# EAGLE design LE1-4 (EAGLE 8.5.1)
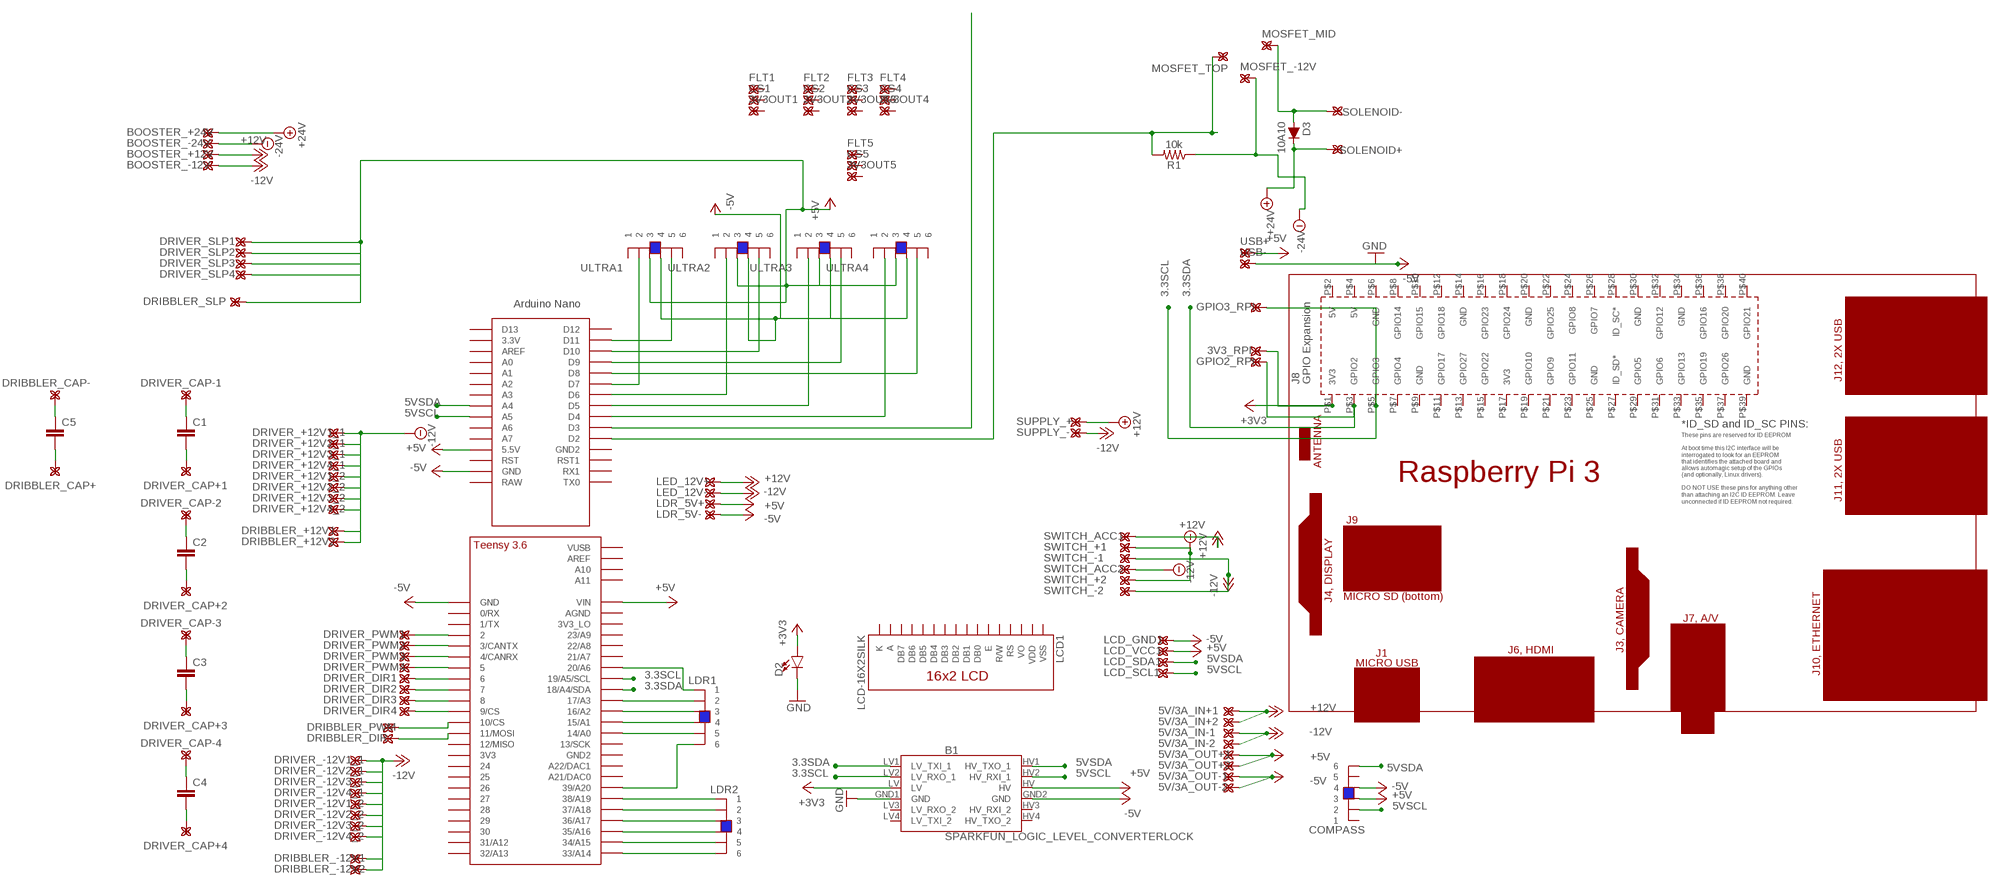
[diagram p0: schematic, sheet 1]

## Parts
3V3_RPI  BETTERPAD_2.54  [SUPERIORSIM]
3V3OUT1  BETTERPAD_2.54  [SUPERIORSIM]
3V3OUT2  BETTERPAD_2.54  [SUPERIORSIM]
3V3OUT3  BETTERPAD_2.54  [SUPERIORSIM]
3V3OUT4  BETTERPAD_2.54  [SUPERIORSIM]
3V3OUT5  BETTERPAD_2.54  [SUPERIORSIM]
5V/3A_IN+1  BETTERPAD_2.54  [SUPERIORSIM]
5V/3A_IN+2  BETTERPAD_2.54  [SUPERIORSIM]
5V/3A_IN-1  BETTERPAD_2.54  [SUPERIORSIM]
5V/3A_IN-2  BETTERPAD_2.54  [SUPERIORSIM]
5V/3A_OUT+1  BETTERPAD_2.54  [SUPERIORSIM]
5V/3A_OUT+2  BETTERPAD_2.54  [SUPERIORSIM]
5V/3A_OUT-1  BETTERPAD_2.54  [SUPERIORSIM]
5V/3A_OUT-2  BETTERPAD_2.54  [SUPERIORSIM]
B1  SPARKFUN_LOGIC_LEVEL_CONVERTERLOCK  [SPARKFUN_LOGIC_LEVEL_CONVERTER_LOCK]
BOOSTER_+12V  BETTERPAD_2.54  [SUPERIORSIM]
BOOSTER_+24V  BETTERPAD_2.54  [SUPERIORSIM]
BOOSTER_-12V  BETTERPAD_2.54  [SUPERIORSIM]
BOOSTER_-24V  BETTERPAD_2.54  [SUPERIORSIM]
C1  C5/7.2  [C5B7.2]
C2  C5/7.2  [C5B7.2]
C3  C5/7.2  [C5B7.2]
C4  C5/7.2  [C5B7.2]
C5  C5/7.2  [C5B7.2]
COMPASS  6P6C_FEMALESMD  [6P6C_FEMALE]
CS1  BETTERPAD_2.54  [SUPERIORSIM]
CS2  BETTERPAD_2.54  [SUPERIORSIM]
CS3  BETTERPAD_2.54  [SUPERIORSIM]
CS4  BETTERPAD_2.54  [SUPERIORSIM]
CS5  BETTERPAD_2.54  [SUPERIORSIM]
D2  LED-3MM-NO_SILK  [LED_3MM-NS]
D3  10A10  DIODE-1N4148  [DIODE-1N4148]
DRIBBLER_+12V1  BETTERPAD_2.54  [SUPERIORSIM]
DRIBBLER_+12V2  BETTERPAD_2.54  [SUPERIORSIM]
DRIBBLER_-12V1  BETTERPAD_2.54  [SUPERIORSIM]
DRIBBLER_-12V2  BETTERPAD_2.54  [SUPERIORSIM]
DRIBBLER_CAP+  BETTERPAD_2.54  [SUPERIORSIM]
DRIBBLER_CAP-  BETTERPAD_2.54  [SUPERIORSIM]
DRIBBLER_DIR  BETTERPAD_2.54  [SUPERIORSIM]
DRIBBLER_PWM  BETTERPAD_2.54  [SUPERIORSIM]
DRIBBLER_SLP  BETTERPAD_2.54  [SUPERIORSIM]
DRIVER_+12V1_1  BETTERPAD_2.54  [SUPERIORSIM]
DRIVER_+12V1_2  BETTERPAD_2.54  [SUPERIORSIM]
DRIVER_+12V2_1  BETTERPAD_2.54  [SUPERIORSIM]
DRIVER_+12V2_2  BETTERPAD_2.54  [SUPERIORSIM]
DRIVER_+12V3_1  BETTERPAD_2.54  [SUPERIORSIM]
DRIVER_+12V3_2  BETTERPAD_2.54  [SUPERIORSIM]
DRIVER_+12V4_1  BETTERPAD_2.54  [SUPERIORSIM]
DRIVER_+12V4_2  BETTERPAD_2.54  [SUPERIORSIM]
DRIVER_-12V1_1  BETTERPAD_2.54  [SUPERIORSIM]
DRIVER_-12V1_2  BETTERPAD_2.54  [SUPERIORSIM]
DRIVER_-12V2_1  BETTERPAD_2.54  [SUPERIORSIM]
DRIVER_-12V2_2  BETTERPAD_2.54  [SUPERIORSIM]
DRIVER_-12V3_1  BETTERPAD_2.54  [SUPERIORSIM]
DRIVER_-12V3_2  BETTERPAD_2.54  [SUPERIORSIM]
DRIVER_-12V4_1  BETTERPAD_2.54  [SUPERIORSIM]
DRIVER_-12V4_2  BETTERPAD_2.54  [SUPERIORSIM]
DRIVER_CAP+1  BETTERPAD_2.54  [SUPERIORSIM]
DRIVER_CAP+2  BETTERPAD_2.54  [SUPERIORSIM]
DRIVER_CAP+3  BETTERPAD_2.54  [SUPERIORSIM]
DRIVER_CAP+4  BETTERPAD_2.54  [SUPERIORSIM]
DRIVER_CAP-1  BETTERPAD_2.54  [SUPERIORSIM]
DRIVER_CAP-2  BETTERPAD_2.54  [SUPERIORSIM]
DRIVER_CAP-3  BETTERPAD_2.54  [SUPERIORSIM]
DRIVER_CAP-4  BETTERPAD_2.54  [SUPERIORSIM]
DRIVER_DIR1  BETTERPAD_2.54  [SUPERIORSIM]
DRIVER_DIR2  BETTERPAD_2.54  [SUPERIORSIM]
DRIVER_DIR3  BETTERPAD_2.54  [SUPERIORSIM]
DRIVER_DIR4  BETTERPAD_2.54  [SUPERIORSIM]
DRIVER_PWM1  BETTERPAD_2.54  [SUPERIORSIM]
DRIVER_PWM2  BETTERPAD_2.54  [SUPERIORSIM]
DRIVER_PWM3  BETTERPAD_2.54  [SUPERIORSIM]
DRIVER_PWM4  BETTERPAD_2.54  [SUPERIORSIM]
DRIVER_SLP1  BETTERPAD_2.54  [SUPERIORSIM]
DRIVER_SLP2  BETTERPAD_2.54  [SUPERIORSIM]
DRIVER_SLP3  BETTERPAD_2.54  [SUPERIORSIM]
DRIVER_SLP4  BETTERPAD_2.54  [SUPERIORSIM]
FLT1  BETTERPAD_2.54  [SUPERIORSIM]
FLT2  BETTERPAD_2.54  [SUPERIORSIM]
FLT3  BETTERPAD_2.54  [SUPERIORSIM]
FLT4  BETTERPAD_2.54  [SUPERIORSIM]
FLT5  BETTERPAD_2.54  [SUPERIORSIM]
GPIO2_RPI  BETTERPAD_2.54  [SUPERIORSIM]
GPIO3_RPI  BETTERPAD_2.54  [SUPERIORSIM]
LCD1  LCD-16X2SILK  [LCD-16X2]
LCD_GND1  BETTERPAD_2.54  [SUPERIORSIM]
LCD_SCL1  BETTERPAD_2.54  [SUPERIORSIM]
LCD_SDA1  BETTERPAD_2.54  [SUPERIORSIM]
LCD_VCC1  BETTERPAD_2.54  [SUPERIORSIM]
LDR1  6P6C_FEMALESMD  [6P6C_FEMALE]
LDR2  6P6C_FEMALESMD  [6P6C_FEMALE]
LDR_5V+  BETTERPAD_2.54  [SUPERIORSIM]
LDR_5V-  BETTERPAD_2.54  [SUPERIORSIM]
LED_12V+  BETTERPAD_2.54  [SUPERIORSIM]
LED_12V-  BETTERPAD_2.54  [SUPERIORSIM]
MOSFET_-12V  BETTERPAD_2.54  [SUPERIORSIM]
MOSFET_MID  BETTERPAD_2.54  [SUPERIORSIM]
MOSFET_TOP  BETTERPAD_2.54  [SUPERIORSIM]
PCB1  RPI3  [RPI3]
R1  10k  10KOHM-HORIZ-1/4W-1%  [AXIAL-0.3]
SOLENOID+  BETTERPAD_2.54  [SUPERIORSIM]
SOLENOID-  BETTERPAD_2.54  [SUPERIORSIM]
SUPPLY_+  BETTERPAD_2.54  [SUPERIORSIM]
SUPPLY_-  BETTERPAD_2.54  [SUPERIORSIM]
SWITCH_+1  BETTERPAD_2.54  [SUPERIORSIM]
SWITCH_+2  BETTERPAD_2.54  [SUPERIORSIM]
SWITCH_-1  BETTERPAD_2.54  [SUPERIORSIM]
SWITCH_-2  BETTERPAD_2.54  [SUPERIORSIM]
SWITCH_ACC1  BETTERPAD_2.54  [SUPERIORSIM]
SWITCH_ACC2  BETTERPAD_2.54  [SUPERIORSIM]
U$1  TEENSY_3.5/3.6_BASIC  [TEENSY_3.5/3.6_BASIC]
U$2  NANO  [NANO]
ULTRA1  6P6C_FEMALESMD  [6P6C_FEMALE]
ULTRA2  6P6C_FEMALESMD  [6P6C_FEMALE]
ULTRA3  6P6C_FEMALESMD  [6P6C_FEMALE]
ULTRA4  6P6C_FEMALESMD  [6P6C_FEMALE]
USB+  BETTERPAD_2.54  [SUPERIORSIM]
USB-  BETTERPAD_2.54  [SUPERIORSIM]

## Nets
3.3SCL: B1.LV2(LV_RXO_1) GPIO3_RPI..(P) PCB1.P$5(GPIO3) U$1.19/A5/SCL
3.3SDA: B1.LV1(LV_TXI_1) GPIO2_RPI..(P) PCB1.P$3(GPIO2) U$1.18/A4/SDA
5VSCL: B1.HV2(HV_RXI_1) LCD_SCL1..(P) U$2.A5
5VSDA: B1.HV1(HV_TXO_1) LCD_SDA1..(P) U$2.A4
+3V3: 3V3_RPI..(P) B1.LV D2.A PCB1.P$1(3V3)
+5V: 5V/3A_OUT+1..(P) 5V/3A_OUT+2..(P) B1.HV COMPASS.3 DRIBBLER_SLP..(P) DRIVER_SLP1..(P) DRIVER_SLP2..(P) DRIVER_SLP3..(P) DRIVER_SLP4..(P) LCD_VCC1..(P) LDR_5V+..(P) U$1.VIN U$2.5V(5.5V) ULTRA1.3 ULTRA2.3 ULTRA3.3 ULTRA4.3 USB+..(P)
+12V: 5V/3A_IN+1..(P) 5V/3A_IN+2..(P) BOOSTER_+12V..(P) D3.C LED_12V+..(P) SOLENOID+..(P) SUPPLY_+..(P) SWITCH_+1..(P) SWITCH_+2..(P) SWITCH_ACC1..(P) ; supply symbol labelled +24V
+24V: BOOSTER_+24V..(P)
-5V: 5V/3A_OUT-1..(P) 5V/3A_OUT-2..(P) B1.GND2(GND) COMPASS.4 LCD_GND1..(P) LDR_5V-..(P) U$1.GND U$2.GND ULTRA1.4 ULTRA2.4 ULTRA3.4 ULTRA4.4
-12V: 5V/3A_IN-1..(P) 5V/3A_IN-2..(P) BOOSTER_-12V..(P) DRIBBLER_+12V1..(P) DRIBBLER_+12V2..(P) DRIBBLER_-12V1..(P) DRIBBLER_-12V2..(P) DRIVER_+12V1_1..(P) DRIVER_+12V1_2..(P) DRIVER_+12V2_1..(P) DRIVER_+12V2_2..(P) DRIVER_+12V3_1..(P) DRIVER_+12V3_2..(P) DRIVER_+12V4_1..(P) DRIVER_+12V4_2..(P) DRIVER_-12V1_1..(P) DRIVER_-12V1_2..(P) DRIVER_-12V2_1..(P) DRIVER_-12V2_2..(P) DRIVER_-12V3_1..(P) DRIVER_-12V3_2..(P) DRIVER_-12V4_1..(P) DRIVER_-12V4_2..(P) LED_12V-..(P) MOSFET_-12V..(P) R1.P$1 SUPPLY_-..(P) SWITCH_-1..(P) SWITCH_-2..(P) SWITCH_ACC2..(P) ; supply symbol labelled -24V
-24V: BOOSTER_-24V..(P)
GND: B1.GND1(GND) D2.K(C) USB-..(P) ; supply symbol labelled -5V
N$1: LDR1.6 U$1.39/A20
N$2: DRIBBLER_PWM..(P) U$1.10/CS
N$3: DRIBBLER_DIR..(P) U$1.11/MOSI
N$4: DRIVER_PWM1..(P) U$1.2
N$5: DRIVER_PWM2..(P) U$1.3/CANTX
N$6: LDR1.2 U$1.17/A3
N$7: LDR1.3 U$1.16/A2
N$8: LDR1.4 U$1.15/A1
N$9: LDR1.5 U$1.14/A0
N$10: LDR1.1 U$1.20/A6
N$11: DRIVER_PWM3..(P) U$1.4/CANRX
N$12: D3.A MOSFET_MID..(P) SOLENOID-..(P)
N$13: MOSFET_TOP..(P) R1.P$2 U$2.D2
N$14: DRIVER_PWM4..(P) U$1.5
N$15: U$2.D3
N$16: C5.1 DRIBBLER_CAP-..(P)
N$17: DRIVER_DIR1..(P) U$1.6
N$18: LDR2.1 U$1.38/A19
N$19: LDR2.2 U$1.37/A18
N$20: LDR2.3 U$1.36/A17
N$21: LDR2.4 U$1.35/A16
N$22: LDR2.5 U$1.34/A15
N$23: LDR2.6 U$1.33/A14
N$24: DRIVER_DIR2..(P) U$1.7
N$25: DRIVER_DIR3..(P) U$1.8
N$26: DRIVER_DIR4..(P) U$1.9/CS
N$27: C5.2 DRIBBLER_CAP+..(P)
N$28: U$2.D11 ULTRA1.5
N$29: U$2.D10 ULTRA2.5
N$30: U$2.D9 ULTRA3.5
N$31: C1.1 DRIVER_CAP-1..(P)
N$32: C1.2 DRIVER_CAP+1..(P)
N$33: C2.1 DRIVER_CAP-2..(P)
N$34: C2.2 DRIVER_CAP+2..(P)
N$35: C3.1 DRIVER_CAP-3..(P)
N$36: C3.2 DRIVER_CAP+3..(P)
N$37: C4.1 DRIVER_CAP-4..(P)
N$38: C4.2 DRIVER_CAP+4..(P)
N$39: U$2.D8 ULTRA4.5
N$40: U$2.D7 ULTRA1.2
N$41: U$2.D6 ULTRA2.2
N$42: U$2.D5 ULTRA3.2
N$43: U$2.D4 ULTRA4.2
Unconnected: 3V3OUT1..(P) 3V3OUT2..(P) 3V3OUT3..(P) 3V3OUT4..(P) 3V3OUT5..(P) B1.HV3(HV_RXI_2) B1.HV4(HV_TXO_2) B1.LV3(LV_RXO_2) B1.LV4(LV_TXI_2) COMPASS.1 COMPASS.2 COMPASS.5 COMPASS.6 CS1..(P) CS2..(P) CS3..(P) CS4..(P) CS5..(P) FLT1..(P) FLT2..(P) FLT3..(P) FLT4..(P) FLT5..(P) LCD1.3(VO) LCD1.4(RS) LCD1.5(R/W) LCD1.6(E) LCD1.7(DB0) LCD1.8(DB1) LCD1.9(DB2) LCD1.10(DB3) LCD1.11(DB4) LCD1.12(DB5) LCD1.13(DB6) LCD1.14(DB7) PCB1.P$2(5V) PCB1.P$4(5V) PCB1.P$6(GND) PCB1.P$7(GPIO4) PCB1.P$8(GPIO14) PCB1.P$9(GND) PCB1.P$10(GPIO15) PCB1.P$11(GPIO17) PCB1.P$12(GPIO18) PCB1.P$13(GPIO27) PCB1.P$14(GND) PCB1.P$15(GPIO22) PCB1.P$16(GPIO23) PCB1.P$17(3V3) PCB1.P$18(GPIO24) PCB1.P$19(GPIO10) PCB1.P$20(GND) PCB1.P$21(GPIO9) PCB1.P$22(GPIO25) PCB1.P$23(GPIO11) PCB1.P$24(GPIO8) PCB1.P$25(GND) PCB1.P$26(GPIO7) PCB1.P$27(ID_SD*) PCB1.P$28(ID_SC*) PCB1.P$29(GPIO5) PCB1.P$30(GND) PCB1.P$31(GPIO6) PCB1.P$32(GPIO12) PCB1.P$33(GPIO13) PCB1.P$34(GND) PCB1.P$35(GPIO19) PCB1.P$36(GPIO16) PCB1.P$37(GPIO26) PCB1.P$38(GPIO20) PCB1.P$39(GND) PCB1.P$40(GPIO21) U$1.0/RX U$1.1/TX U$1.3V3 U$1.3V3_LO U$1.12/MISO U$1.13/SCK U$1.21/A7 U$1.21/DAC0(A21/DAC0) U$1.22/A8 U$1.23/A9 U$1.24 U$1.25 U$1.26 U$1.27 U$1.28 U$1.29 U$1.30 U$1.31/A12 U$1.32/A13 U$1.A10 U$1.A11 U$1.A22/DAC1 U$1.AGND U$1.AREF U$1.GND2 U$1.VUSB U$2.3.3V U$2.A0 U$2.A1 U$2.A2 U$2.A3 U$2.A6 U$2.A7 U$2.AREF U$2.D12 U$2.D13 U$2.GND1(GND2) U$2.ICSP1 U$2.ICSP2 U$2.ICSP3 U$2.ICSP4 U$2.ICSP5 U$2.ICSP6 U$2.RAW U$2.RST U$2.RST1 U$2.RX1 U$2.TX0 ULTRA1.1 ULTRA1.6 ULTRA2.1 ULTRA2.6 ULTRA3.1 ULTRA3.6 ULTRA4.1 ULTRA4.6

## Power pins joined to a net without a drawn wire
A: LCD1.15(A)
K: LCD1.16(K)
VDD: LCD1.2(VDD)
VSS: LCD1.1(VSS)

## Library data of the parts
3V3_RPI 3V3OUT1-3V3OUT5 5V/3A_IN+1 5V/3A_IN+2 5V/3A_IN-1 5V/3A_IN-2 5V/3A_OUT+1 5V/3A_OUT+2 5V/3A_OUT-1 5V/3A_OUT-2 BOOSTER_+12V BOOSTER_+24V BOOSTER_-12V BOOSTER_-24V CS1-CS5 DRIBBLER_+12V1 DRIBBLER_+12V2 DRIBBLER_-12V1 DRIBBLER_-12V2 DRIBBLER_CAP+ DRIBBLER_CAP- DRIBBLER_DIR DRIBBLER_PWM DRIBBLER_SLP DRIVER_+12V1_1 DRIVER_+12V1_2 DRIVER_+12V2_1 DRIVER_+12V2_2 DRIVER_+12V3_1 DRIVER_+12V3_2 DRIVER_+12V4_1 DRIVER_+12V4_2 DRIVER_-12V1_1 DRIVER_-12V1_2 DRIVER_-12V2_1 DRIVER_-12V2_2 DRIVER_-12V3_1 DRIVER_-12V3_2 DRIVER_-12V4_1 DRIVER_-12V4_2 DRIVER_CAP+1-DRIVER_CAP+4 DRIVER_CAP-1-DRIVER_CAP-4 DRIVER_DIR1-DRIVER_DIR4 DRIVER_PWM1-DRIVER_PWM4 DRIVER_SLP1-DRIVER_SLP4 FLT1-FLT5 GPIO2_RPI GPIO3_RPI LCD_GND1 LCD_SCL1 LCD_SDA1 LCD_VCC1 LDR_5V+ LDR_5V- LED_12V+ LED_12V- MOSFET_-12V MOSFET_MID MOSFET_TOP SOLENOID+ SOLENOID- SUPPLY_+ SUPPLY_- SWITCH_+1 SWITCH_+2 SWITCH_-1 SWITCH_-2 SWITCH_ACC1 SWITCH_ACC2 USB+ USB- = Yijiano:BETTERPAD_2.54
B1 = SparkFun-Boards:SPARKFUN_LOGIC_LEVEL_CONVERTER: SparkFun Logic Level Converter -Bi-Directional This is the mechnical outline for the 3.3V - 5V bi directional logic level converter. *Note, the "LOCK" Package has the header pins staggered by an offset of 5 mils (off center line), so that when you slide a row of standard 0.1" headers into the PTH pads, it will hold position vertically. See the follwing turorial for more information on this type of special footprints: Sneaky Footprints <https://www.sparkfun.com/tutorials/114> SparkFun Products: SparkFun Logic Level Converter - Bi-Directional <https://www.sparkfun.com/products/12009>
C1-C5 = capacitor-wima:C: CAPACITOR naming: grid - package width
COMPASS LDR1 LDR2 ULTRA1-ULTRA4 = Yijiano:6P6C_FEMALE
D2 = SparkFun-LED:LED: LED (Generic) Standard schematic elements and footprints for 5mm, 3mm, 1206, and 0603 sized LEDs. Generic LEDs with no color specified.
D3 = SparkFun-DiscreteSemi:DIODE: Diode These are standard reverse protection diodes and small signal diodes. SparkFun Products: SparkFun SparkPunk Sound Kit <https://www.sparkfun.com/products/11177> SparkFun ESP8266 Thing <https://www.sparkfun.com/products/13231>; PROD_ID: DIO-08378; VALUE: 200mA/100V/1V
LCD1 = SparkFun-Displays:LCD-16X2: Standard text-only 16x2 parallel input LCD Basic 16 character by 2 line display. Typically utilizes the extremely common HD44780 parallel interface chipset SparkFun Products: Basic 16x2 Green <https://www.sparkfun.com/products/255> Basic 8x2 Green <https://www.sparkfun.com/products/11122>; SF_ID: LCD-00255
PCB1 = e14_Rpi3_RevA:RPI3: Device for Raspberry Pi 3 board created by Dave Young for www.element14.com More information and support community is available at https://www.element14.com/community/community/raspberry-pi
R1 = SparkFun-Resistors:10KOHM: 10kΩ resistor A resistor is a passive two-terminal electrical component that implements electrical resistance as a circuit element. Resistors act to reduce current flow, and, at the same time, act to lower voltage levels within circuits. - Wikipedia; PROD_ID: RES-12183
U$1 = Teensy356:TEENSY_3.5/3.6_BASIC
U$2 = Arduino-clone:NANO: Arduino Nano

## Board
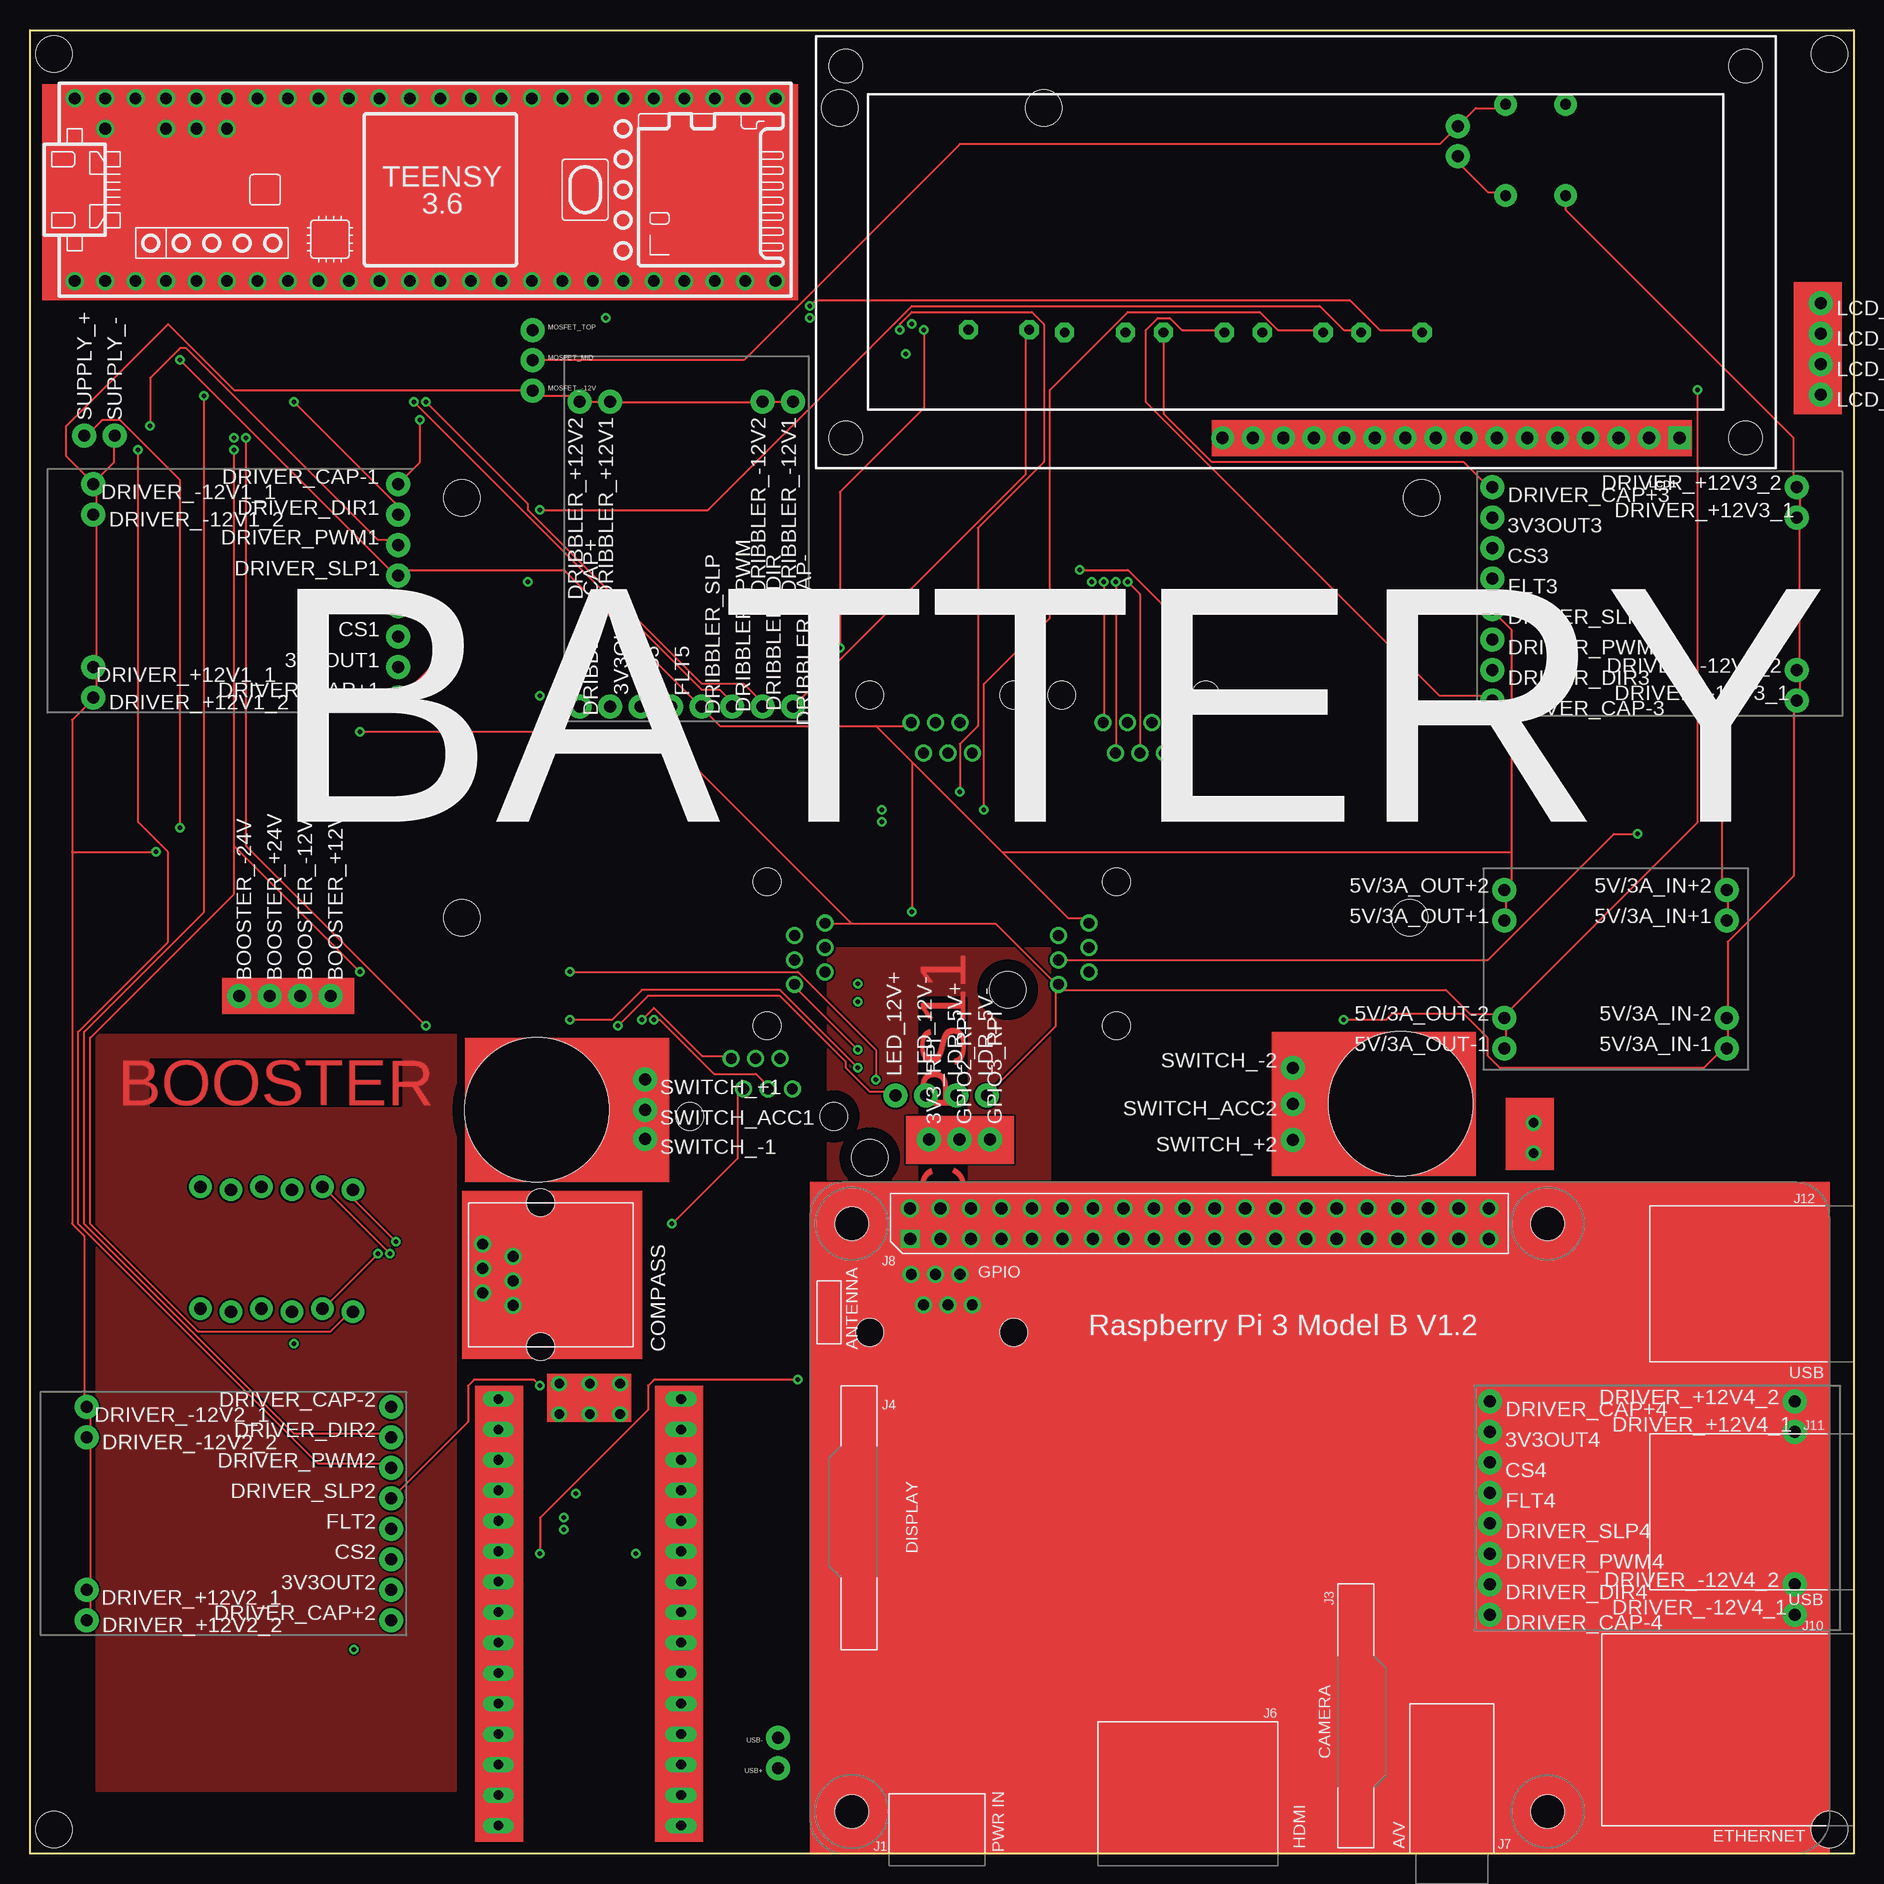
[diagram p1: board, top side]
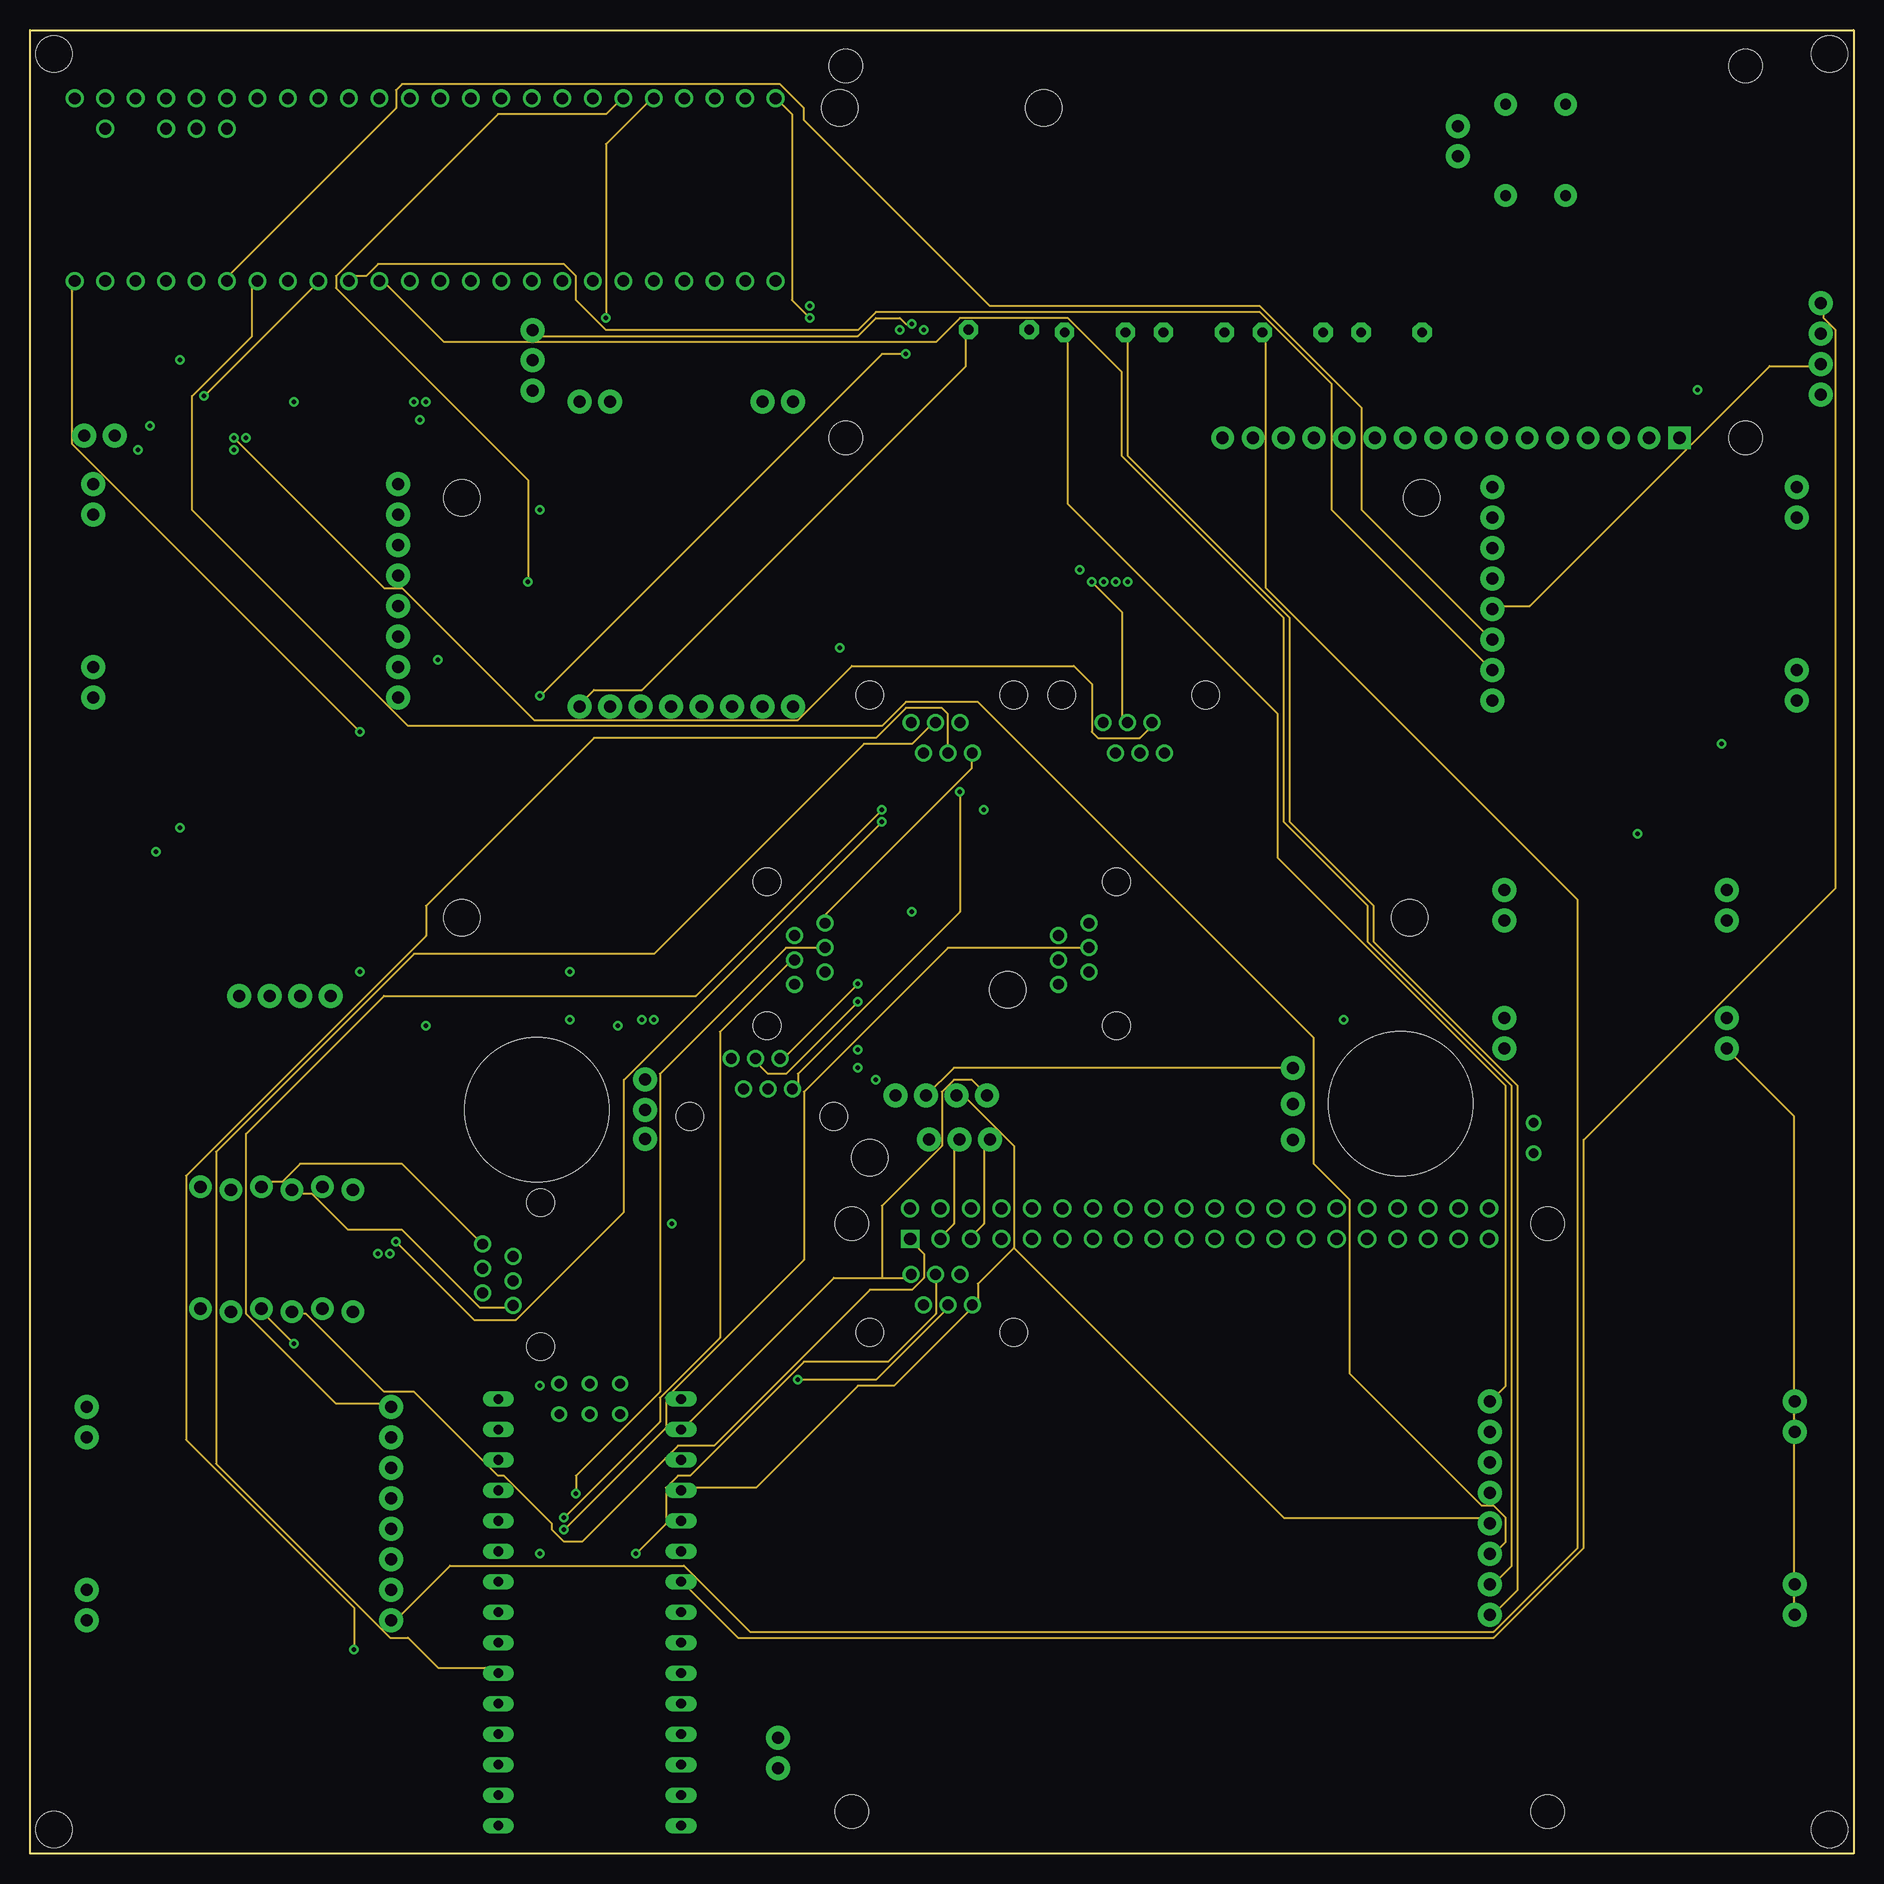
[diagram p2: board, inner layer Route2]
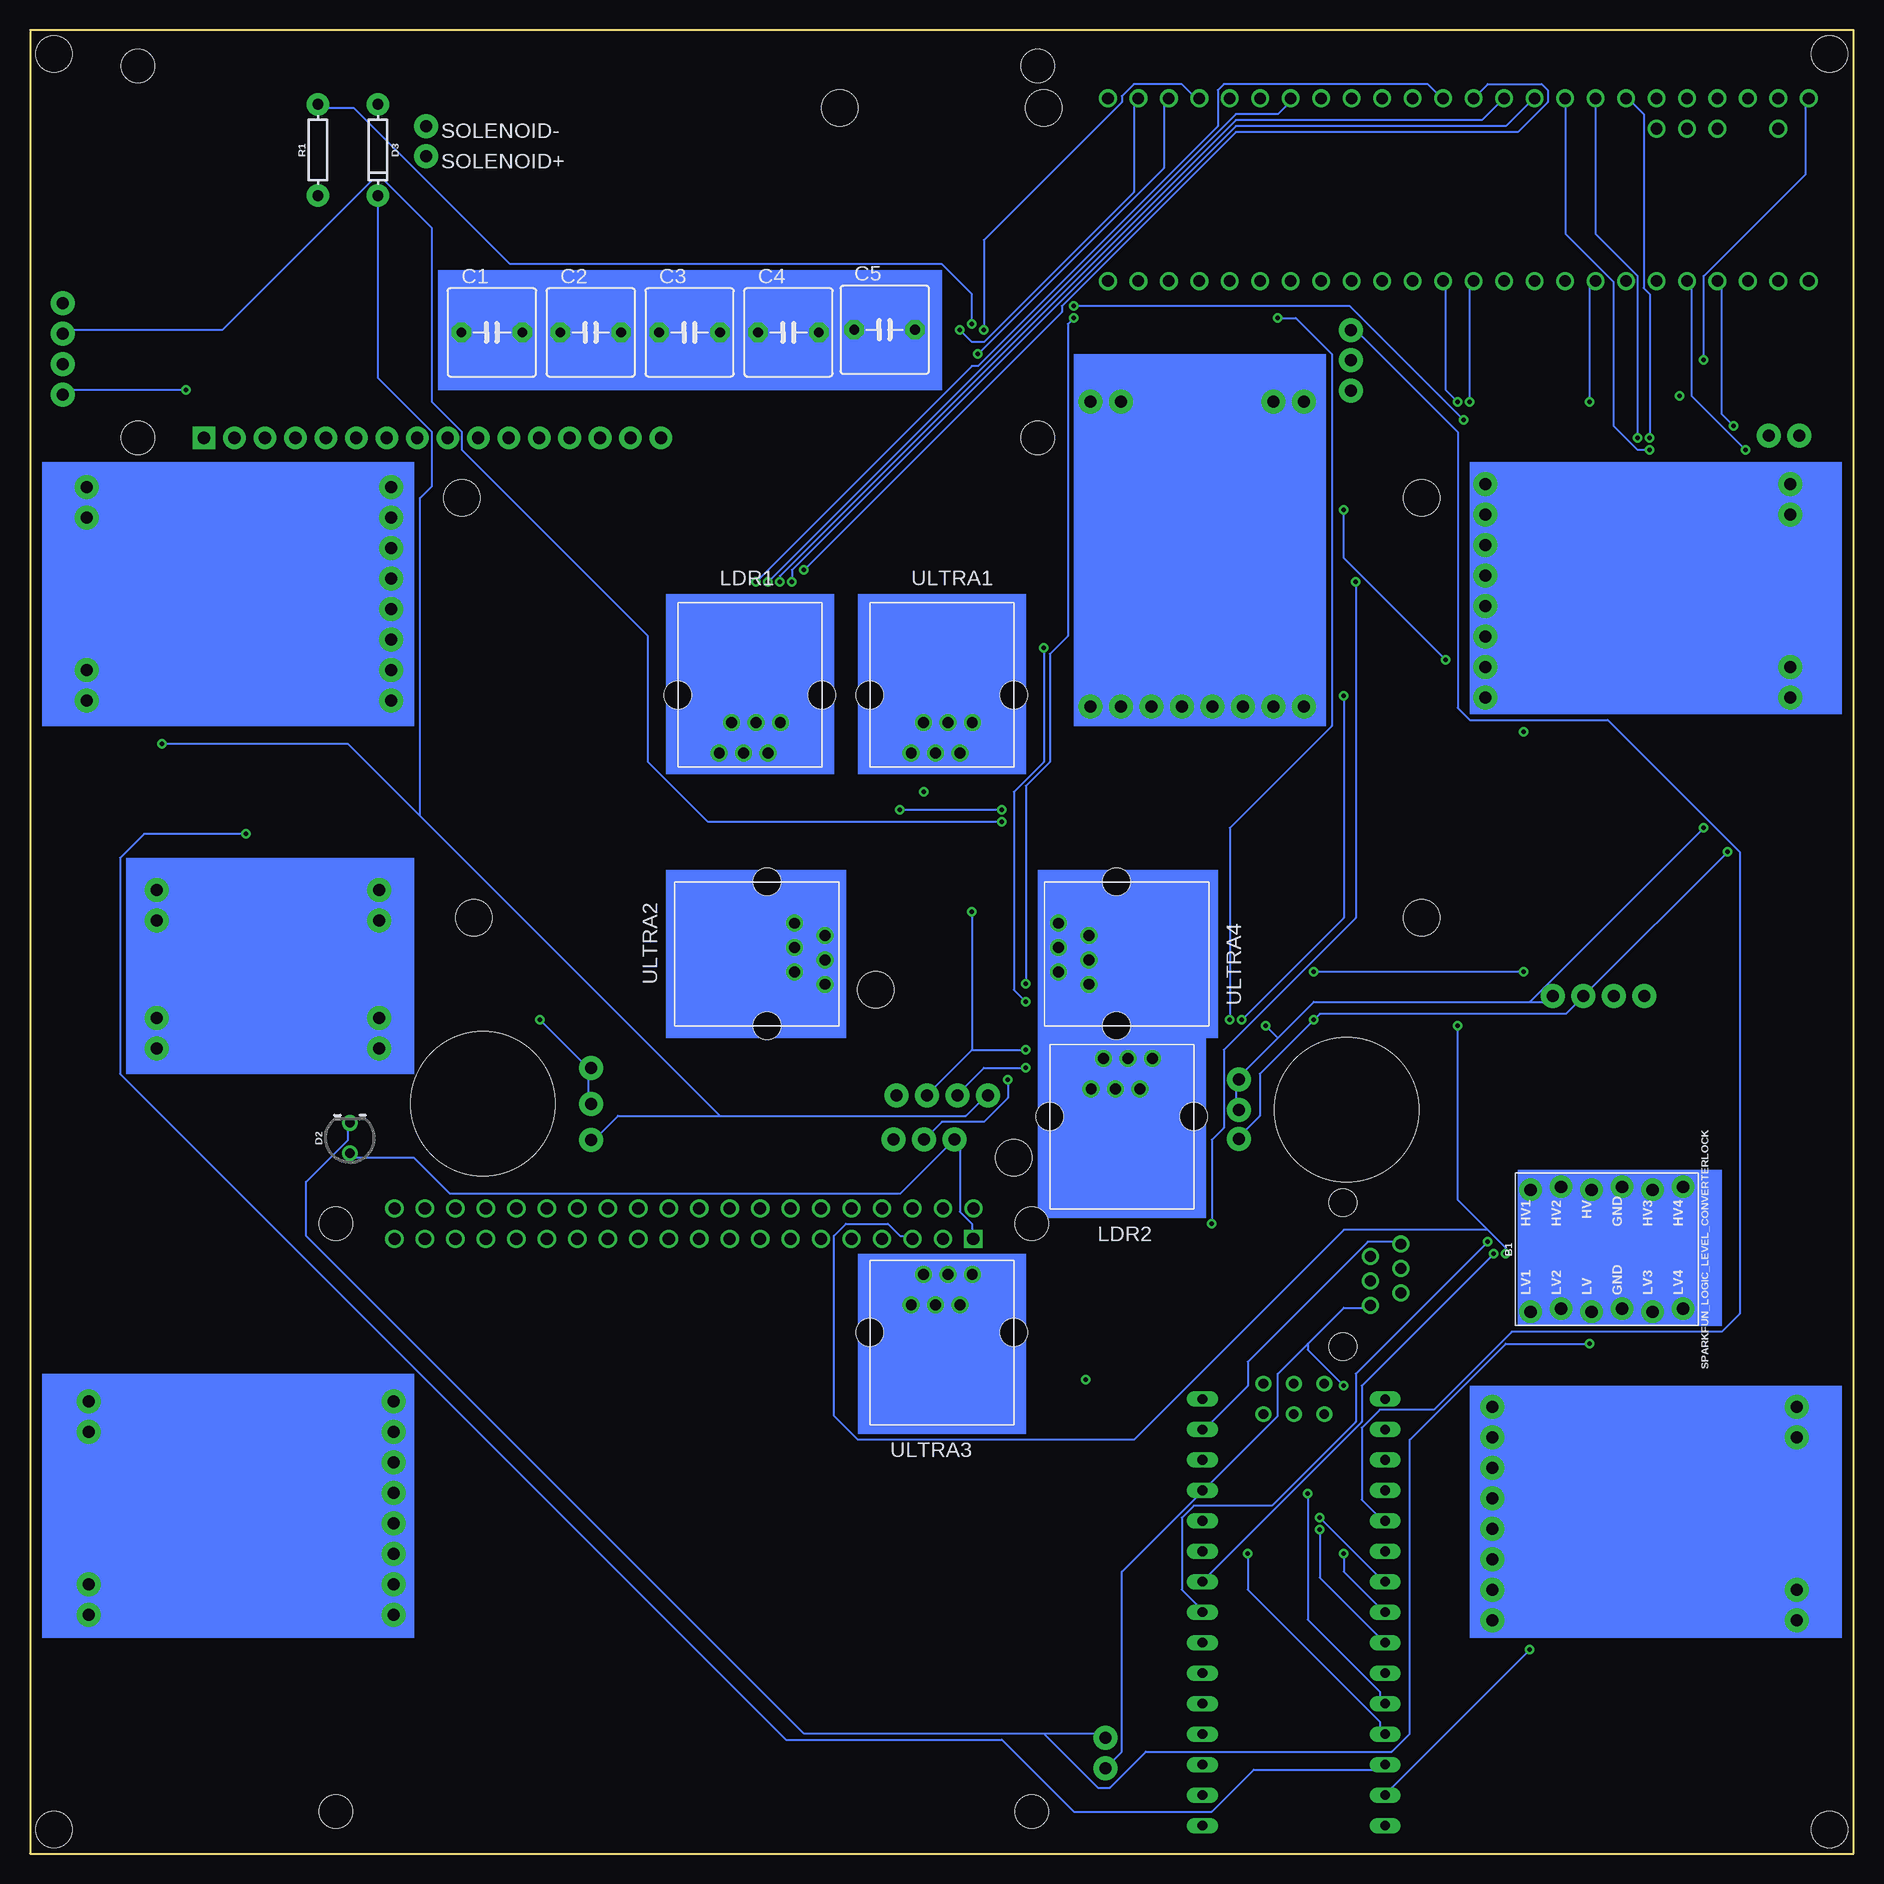
[diagram p3: board, bottom side, seen from below]

Size 152 x 152 mm. Coordinates in mm from the lower left corner, seen from the top.
Outline: 0,0 0,152 152,152 152,0 0,0
Copper layers (1*2*16): Top 0.035mm / dielectric 1.5mm / Route2 0.035mm / dielectric 0.15mm / Bottom 0.035mm
Design rules "default *": minimum track width 6mil, minimum drill 0.35mm, track to track 6mil, track to pad 6mil, pad to pad 6mil, via to via 6mil, smd to smd 6mil, copper to edge 40mil, drill to drill 6mil, minimum pad ring 10mil, minimum via ring 8mil, stop-mask expansion 4mil, vias tented up to drill 0mil, thermal gap 10mil
Holes 12 mm at 42.25,62 114.25,62.5
Holes 3 mm at 2,150 150,150 150,2 2,2 81.5,72 70,58 115,78 116,113 36,113 36,78 67.5,145.5 84.5,145.5

### Footprints (pad centres in the part's own frame; a part is rotated, then mirrored left to right if it is on the bottom)
SUPERIORSIM = drill 1 pad 2: . 0,0
SPARKFUN_LOGIC_LEVEL_CONVERTER_LOCK = drill 1.016 pad 1.88: GND1 -4.953,-1.27; GND2 5.207,-1.27; HV 4.953,1.27; HV1 4.953,6.35; HV2 5.207,3.81; HV3 4.953,-3.81; HV4 5.207,-6.35; LV -5.207,1.27; LV1 -5.207,6.35; LV2 -4.953,3.81; LV3 -5.207,-3.81; LV4 -4.953,-6.35
C5B7.2 = drill 0.813 pad 1.6 octagon: 1 -2.54,0; 2 2.54,0
6P6C_FEMALE = drill 0.9 pad 1.3: 1 -1.53,1.27; 2 0.51,1.27; 3 2.55,1.27; 4 -2.55,-1.27; 5 -0.51,-1.27; 6 1.53,-1.27 | hole 2.3: -6,3.57; 6,3.57
LED_3MM-NS = drill 0.813: A -1.27,0; K 1.27,0
DIODE-1N4148 = drill 0.9 pad 1.88: A -3.81,0; C 3.81,0
LCD-16X2 = drill 1.016 pad 1.88 square: 1 -32,15.5 | drill 1.016 pad 1.88: 2 -29.46,15.5; 3 -26.92,15.5; 4 -24.38,15.5; 5 -21.84,15.5; 6 -19.3,15.5; 7 -16.76,15.5; 8 -14.22,15.5; 9 -11.68,15.5; 10 -9.14,15.5; 11 -6.6,15.5; 12 -4.06,15.5; 13 -1.52,15.5; 14 1.02,15.5; 15 3.56,15.5; 16 6.1,15.5 | hole 2.8: -37.5,15.5; -37.5,-15.5; 37.5,15.5; 37.5,-15.5
RPI3 = drill 1.016 square: P$1 8.37,51.23 | drill 1.016: P$2 8.357,53.772; P$3 10.897,51.232; P$4 10.897,53.772; P$5 13.437,51.232; P$6 13.437,53.772; P$7 15.977,51.232; P$8 15.977,53.772; P$9 18.517,51.232; P$10 18.517,53.772; P$11 21.057,51.232; P$12 21.057,53.772; P$13 23.597,51.232; P$14 23.597,53.772; P$15 26.137,51.232; P$16 26.137,53.772; P$17 28.677,51.232; P$18 28.677,53.772; P$19 31.217,51.232; P$20 31.217,53.772; P$21 33.757,51.232; P$22 33.757,53.772; P$23 36.297,51.232; P$24 36.297,53.772; P$25 38.837,51.232; P$26 38.837,53.772; P$27 41.377,51.232; P$28 41.377,53.772; P$29 43.917,51.232; P$30 43.917,53.772; P$31 46.457,51.232; P$32 46.457,53.772; P$33 48.997,51.232; P$34 48.997,53.772; P$35 51.537,51.232; P$36 51.537,53.772; P$37 54.077,51.232; P$38 54.077,53.772; P$39 56.617,51.232; P$40 56.617,53.772 | hole 2.75: 3.5,3.5; 61.5,3.5; 3.5,52.5; 61.5,52.5
AXIAL-0.3 = drill 0.9 pad 1.88: P$1 -3.81,0; P$2 3.81,0
TEENSY_3.5/3.6_BASIC = drill 0.965: 0/RX -25.4,-7.62; 1/TX -22.86,-7.62; 2 -20.32,-7.62; 3/CANTX -17.78,-7.62; 3V3 7.62,-7.62; 3V3_LO -22.86,7.62; 4/CANRX -15.24,-7.62; 5 -12.7,-7.62; 6 -10.16,-7.62; 7 -7.62,-7.62; 8 -5.08,-7.62; 9/CS -2.54,-7.62; 10/CS 0,-7.62; 11/MOSI 2.54,-7.62; 12/MISO 5.08,-7.62; 13/SCK 5.08,7.62; 14/A0 2.54,7.62; 15/A1 0,7.62; 16/A2 -2.54,7.62; 17/A3 -5.08,7.62; 18/A4/SDA -7.62,7.62; 19/A5/SCL -10.16,7.62; 20/A6 -12.7,7.62; 21/A7 -15.24,7.62; 21/DAC0 12.7,7.62; 22/A8 -17.78,7.62; 23/A9 -20.32,7.62; 24 10.16,-7.62; 25 12.7,-7.62; 26 15.24,-7.62; 27 17.78,-7.62; 28 20.32,-7.62; 29 22.86,-7.62; 30 25.4,-7.62; 31/A12 27.94,-7.62; 32/A13 30.48,-7.62; 33/A14 30.48,7.62; 34/A15 27.94,7.62; 35/A16 25.4,7.62; 36/A17 22.86,7.62; 37/A18 20.32,7.62; 38/A19 17.78,7.62; 39/A20 15.24,7.62; A10 -17.78,5.08; A11 -15.24,5.08; A22/DAC1 10.16,7.62; AGND -25.4,7.62; AREF -20.32,5.08; GND -27.94,-7.62; GND2 7.62,7.62; VIN -27.94,7.62; VUSB -25.4,5.08
NANO = drill 0.8 long: 3.3V -10.16,24.13; 5V -10.16,-1.27; A0 -10.16,19.05; A1 -10.16,16.51; A2 -10.16,13.97; A3 -10.16,11.43; A4 -10.16,8.89; A5 -10.16,6.35; A6 -10.16,3.81; A7 -10.16,1.27; AREF -10.16,21.59; D2 5.08,1.27; D3 5.08,3.81; D4 5.08,6.35; D5 5.08,8.89; D6 5.08,11.43; D7 5.08,13.97; D8 5.08,16.51; D9 5.08,19.05; D10 5.08,21.59; D11 5.08,24.13; D12 5.08,26.67; D13 -10.16,26.67; GND -10.16,-6.35; GND1 5.08,-1.27; RAW -10.16,-8.89; RST -10.16,-3.81; RST1 5.08,-3.81; RX1 5.08,-6.35; TX0 5.08,-8.89 | drill 0.8: ICSP1 -5.08,-10.16; ICSP2 -5.08,-7.62; ICSP3 -2.54,-10.16; ICSP4 -2.54,-7.62; ICSP5 0,-10.16; ICSP6 0,-7.62

### Placement (x,y rotation side)
3V3_RPI  74.93,59.52 90 top
3V3OUT1  30.68,98.91 180 top
3V3OUT2  30.12,21.99 180 top
3V3OUT3  121.88,111.36 0 top
3V3OUT4  121.69,35.15 0 top
3V3OUT5  48.37,95.61 270 top
5V/3A_IN+1  141.46,77.78 180 top
5V/3A_IN+2  141.46,80.32 180 top
5V/3A_IN-1  141.46,67.12 180 top
5V/3A_IN-2  141.46,69.66 180 top
5V/3A_OUT+1  122.91,77.78 180 top
5V/3A_OUT+2  122.91,80.32 180 top
5V/3A_OUT-1  122.91,67.12 180 top
5V/3A_OUT-2  122.91,69.66 180 top
B1  20.56,50.37 90 bottom
BOOSTER_+12V  25.06,71.48 90 top
BOOSTER_+24V  19.98,71.48 90 top
BOOSTER_-12V  22.52,71.48 90 top
BOOSTER_-24V  17.44,71.48 90 top
C1  113.5,126.8 0 bottom
C2  105.26,126.8 0 bottom
C3  97.02,126.8 0 bottom
C4  88.78,126.8 0 bottom
C5  80.76,127.02 0 bottom
COMPASS  39,48.25 270 top
CS1  30.68,101.45 180 top
CS2  30.12,24.53 180 top
CS3  121.88,108.82 0 top
CS4  121.69,32.61 0 top
CS5  50.91,95.61 270 top
D2  125.33,59.64 90 bottom
D3  123,142 270 bottom
DRIBBLER_+12V1  48.37,121.01 270 top
DRIBBLER_+12V2  45.83,121.01 270 top
DRIBBLER_-12V1  63.61,121.01 270 top
DRIBBLER_-12V2  61.07,121.01 270 top
DRIBBLER_CAP+  45.83,95.61 270 top
DRIBBLER_CAP-  63.61,95.61 270 top
DRIBBLER_DIR  61.07,95.61 270 top
DRIBBLER_PWM  58.53,95.61 270 top
DRIBBLER_SLP  55.99,95.61 270 top
DRIVER_+12V1_1  5.28,98.91 180 top
DRIVER_+12V1_2  5.28,96.37 0 top
DRIVER_+12V2_1  4.72,21.99 180 top
DRIVER_+12V2_2  4.72,19.45 0 top
DRIVER_+12V3_1  147.28,111.36 0 top
DRIVER_+12V3_2  147.28,113.9 180 top
DRIVER_+12V4_1  147.09,35.15 0 top
DRIVER_+12V4_2  147.09,37.69 180 top
DRIVER_-12V1_1  5.28,114.15 180 top
DRIVER_-12V1_2  5.28,111.61 0 top
DRIVER_-12V2_1  4.72,37.23 180 top
DRIVER_-12V2_2  4.72,34.69 0 top
DRIVER_-12V3_1  147.28,96.12 0 top
DRIVER_-12V3_2  147.28,98.66 180 top
DRIVER_-12V4_1  147.09,19.91 0 top
DRIVER_-12V4_2  147.09,22.45 180 top
DRIVER_CAP+1  30.68,96.37 180 top
DRIVER_CAP+2  30.12,19.45 180 top
DRIVER_CAP+3  121.88,113.9 0 top
DRIVER_CAP+4  121.69,37.69 0 top
DRIVER_CAP-1  30.68,114.15 180 top
DRIVER_CAP-2  30.12,37.23 180 top
DRIVER_CAP-3  121.88,96.12 0 top
DRIVER_CAP-4  121.69,19.91 0 top
DRIVER_DIR1  30.68,111.61 180 top
DRIVER_DIR2  30.12,34.69 180 top
DRIVER_DIR3  121.88,98.66 0 top
DRIVER_DIR4  121.69,22.45 0 top
DRIVER_PWM1  30.68,109.07 180 top
DRIVER_PWM2  30.12,32.15 180 top
DRIVER_PWM3  121.88,101.2 0 top
DRIVER_PWM4  121.69,24.99 0 top
DRIVER_SLP1  30.68,106.53 180 top
DRIVER_SLP2  30.12,29.61 180 top
DRIVER_SLP3  121.88,103.74 0 top
DRIVER_SLP4  121.69,27.53 0 top
FLT1  30.68,103.99 180 top
FLT2  30.12,27.07 180 top
FLT3  121.88,106.28 0 top
FLT4  121.69,30.07 0 top
FLT5  53.45,95.61 270 top
GPIO2_RPI  77.47,59.52 90 top
GPIO3_RPI  80.01,59.52 90 top
LCD1  105.5,133.5 180 top
LCD_GND1  149.28,121.6 0 top
LCD_SCL1  149.28,129.22 0 top
LCD_SDA1  149.28,126.68 0 top
LCD_VCC1  149.28,124.14 0 top
LDR1  92,93 0 bottom
LDR2  61,65 180 bottom
LDR_5V+  77.22,63.18 90 top
LDR_5V-  79.76,63.18 90 top
LED_12V+  72.14,63.18 90 top
LED_12V-  74.68,63.18 90 top
MOSFET_-12V  41.91,121.92 0 top
MOSFET_MID  41.91,124.46 0 top
MOSFET_TOP  41.91,127 0 top
PCB1  65,0 0 top
R1  128,142 90 bottom
SOLENOID+  119,141.46 0 bottom
SOLENOID-  119,144 0 bottom
SUPPLY_+  4.52,118.18 90 top
SUPPLY_-  7.06,118.18 90 top
SWITCH_+1  51.25,64.54 0 top
SWITCH_+2  105.25,59.5 180 top
SWITCH_-1  51.25,59.56 0 top
SWITCH_-2  105.25,65.5 180 top
SWITCH_ACC1  51.25,62 0 top
SWITCH_ACC2  105.25,62.5 180 top
U$1  31.67,138.69 0 top
U$2  44.11,29 180 top
ULTRA1  76,93 0 bottom
ULTRA2  87,75 90 bottom
ULTRA3  76,47 180 bottom
ULTRA4  65,75 270 bottom
USB+  62.37,7.09 180 top
USB-  62.37,9.63 180 top

### Tracks (layer width: path | path; a pad name or v marks a point on that pad's centre or on a via)
3.3SCL  (via drill 0.35)
  Top 0.152: v18,118 18,84 v33,69 | v29,50 24.5,45.5 B1.LV2
  Route2 0.152: PCB1.P$5 78.5,51.5 79.5,52.5 79.5,59 80,59.5 GPIO3_RPI..
  Bottom 0.152: v18,118 18,131.5 21.5,135 21.5,146 U$1.19/A5/SCL | v33,69 33,54.5 30.5,52 | 30.5,52 29,50.5 v29,50 | 30.5,52 42.5,52 60,34.5 83,34.5 85,36.5 85,51.5 84,52.5 80.5,52.5 79.5,51.5 78.5,51.5 PCB1.P$5
3.3SDA  (via drill 0.35)
  Top 0.152: 17,84 17,80 5,68 5,52.5 14,43.5 25,43.5 26.5,45 B1.LV1 | 17,84 v17,117 | v70.5,64.5 70.5,67 64,73.5 v45,73.5 | 17,84 v27.5,73.5
  Route2 0.152: PCB1.P$3 76,51.5 77,52.5 77,59.5 GPIO2_RPI..
  Bottom 0.152: v17,117 18,117 20,119 20,131 24,135 24,146 U$1.18/A4/SDA | v70.5,64.5 70.5,63 72.5,61 76,61 77,60 GPIO2_RPI.. | v27.5,73.5 v45,73.5
5VSCL  (via drill 0.35)
  Top 0.152: v30,50 24.5,55.5 B1.HV2
  Route2 0.152: LCD_SCL1.. 149.5,129 149.5,128 150.5,127 150.5,80.5 129.5,59.5 129.5,25.5 122,18 59,18 54.5,22.5 U$2.A5
  Bottom 0.152: v30,50 41,39 41,36 54,23 U$2.A5
5VSDA  (via drill 0.35)
  Top 0.152: v30.5,51 26.5,55 B1.HV1
  Route2 0.152: v71,86 49.5,64.5 49.5,53.5 40.5,44.5 37,44.5 v30.5,51
  Bottom 0.152: v30.5,51 41.5,40 41.5,36 48.5,29 55,29 56,28 56,22 54.5,20.5 U$2.A4 | v71,86 95.5,86 100.5,91 100.5,101.5 116,117 116,118.5 118.5,121 118.5,135.5 122.5,139.5 123.5,139.5 136,127 149,127 LCD_SDA1..
+3V3
  Route2 0.152: B1.LV 22,45 23,45 29.5,38.5 32,38.5 39,31.5 39.5,31.5 43.5,27.5 43.5,27 44.5,26 46,26 54,34 57,34 70,47 73.5,47 74.5,48 74.5,50 73.5,51 PCB1.P$1
  Bottom 0.152: D2.A 125,58 120,58 117,55 79.5,55 75,59.5 3V3_RPI.. 74.5,59.5 74.5,53.5 73.5,52.5 73.5,51.5 PCB1.P$1
+5V  (via drill 0.35)
  Top 0.152: v42.5,39 42,39.5 37,39.5 36.5,39 36.5,36 30.5,30 DRIVER_SLP2.. | v69,67 64,72 ULTRA4.3 | 5V/3A_OUT+1.. 123,78 123,80 5V/3A_OUT+2.. 123,80.5 123.5,81 123.5,83.5 | 123.5,83.5 123.5,102 122,103.5 DRIVER_SLP3.. | 70.5,94 57.5,94 56,95.5 DRIBBLER_SLP.. 55.5,96 44.5,107 31,107 DRIVER_SLP1.. 30.5,106.5 v12.5,124.5 | 70.5,94 73,94 ULTRA1.3 | 70.5,94 73.5,91 | 73.5,91 81,83.5 | 81,83.5 86.5,78 88,78 ULTRA2.3 | 81,83.5 123.5,83.5 | 73.5,91 v73.5,78.5
  Route2 0.152: B1.HV 22,55 23.5,55 26.5,52 31,52 37.5,45.5 40,45.5 COMPASS.3 | 82,50.5 79,47.5 79,46 ULTRA3.3 78.5,45.5 72,39 69,39 60.5,30.5 54.5,30.5 U$2.5V | 82,50.5 82,59 77.5,63.5 LDR_5V+.. | 82,50.5 104.5,28 121.5,28 DRIVER_SLP4.. | LCD_VCC1.. 149,124 145,124 125,104 122,104 DRIVER_SLP3..
  Bottom 0.152: USB+.. 62,7.5 61,8.5 61,23.5 54.5,30 U$2.5V 54,30.5 48,36.5 48,40 45.5,42.5 | 45.5,42.5 42.5,45.5 40.5,45.5 COMPASS.3 | v42.5,39 45.5,42 45.5,42.5 | 73.5,67 v69,67 | 73.5,67 77,63.5 LDR_5V+.. | v12.5,124.5 12.5,131.5 4,140 4,146 U$1.VIN | v73.5,78.5 73.5,67
+12V  (via drill 0.35)
  Top 0.152: v12.5,85.5 12.5,114.5 7.5,119.5 6,119.5 5,118.5 SUPPLY_+.. | D3.C 123,138.5 121.5,138.5 119,141 SOLENOID+.. | 5V/3A_IN+1.. 141.5,78 141.5,80 5V/3A_IN+2.. 141,80.5 v141,92.5 | v49,69 51.5,71.5 62.5,71.5 68,66 68,65.5 70,63.5 72,63.5 LED_12V+..
  Bottom 0.152: SWITCH_ACC1.. 51.5,62 51.5,64.5 SWITCH_+1.. 51,65 48,68 | 27,71 45,71 48,68 | 27,71 25.5,71 BOOSTER_+12V.. | 27,71 v12.5,85.5 | 94.5,61.5 103,61.5 105,59.5 SWITCH_+2.. | 94.5,61.5 74,61.5 72.5,63 LED_12V+.. | v141,92.5 125.5,92.5 119.5,86.5 | 94.5,61.5 119.5,86.5 | D3.C 123,123 118.5,118.5 118.5,114 119.5,113 119.5,86.5 | v49,69 48,68
-5V  (via drill 0.35)
  Top 0.152: 5V/3A_OUT-1.. 123,67.5 123,69.5 5V/3A_OUT-2.. | v139,122 139,86 123,70 5V/3A_OUT-2.. | ULTRA2.4 85.5,72 85.5,69 80,63.5 LDR_5V-.. | 68.5,77.5 80.5,77.5 85.5,72.5 ULTRA2.4 | 68.5,77.5 66.5,77.5 ULTRA4.4 | v27.5,93.5 52.5,93.5 68.5,77.5 | 5V/3A_OUT-2.. 122.5,70 120,70 118,72 86,72 ULTRA2.4
  Route2 0.152: 71,48 67,48 54.5,35.5 U$2.GND | 71,48 73,48 ULTRA3.4 | B1.GND2 19.5,56 21,56 22.5,57.5 31,57.5 37.5,51 COMPASS.4 | ULTRA1.4 78.5,91.5 78.5,90.5 66,78 ULTRA4.4 | v27.5,93.5 3.5,117.5 3.5,131 U$1.GND | 71,48 71,54 76,59 76,63.5 77,64.5 78.5,64.5 79.5,63.5 LDR_5V-..
  Bottom 0.152: v139,122 149,122 LCD_GND1.. | U$2.GND 54,35.5 50.5,39 50.5,41 40.5,51 38,51 COMPASS.4
-12V  (via drill 0.35)
  Top 0.152: DRIBBLER_-12V1.. 63.5,121 61.5,121 DRIBBLER_-12V2.. 61,121 48.5,121 DRIBBLER_+12V1.. 48,121 46,121 DRIBBLER_+12V2.. 45.5,121.5 42,121.5 MOSFET_-12V.. 41.5,122 17,122 11.5,127.5 3,119 3,116.5 5,114.5 DRIVER_-12V1_1.. | DRIVER_+12V2_2.. 5,19.5 5,21.5 DRIVER_+12V2_1.. 5,22 5,34.5 DRIVER_-12V2_2.. 5,35 5,37 DRIVER_-12V2_1.. 4.5,37.5 4.5,51.5 3.5,52.5 3.5,83.5 | DRIVER_-12V1_1.. 5.5,114 5.5,112 DRIVER_-12V1_2.. 5.5,111.5 5.5,99 DRIVER_+12V1_1.. 5.5,98.5 5.5,96.5 DRIVER_+12V1_2.. 5,96 3.5,94.5 3.5,83.5 | SUPPLY_-.. 7,118 7,116 5.5,114.5 DRIVER_-12V1_1.. | 3.5,83.5 v10.5,83.5 | R1.P$1 128,137 147,118 147,114 DRIVER_+12V3_2.. 147.5,113.5 147.5,111.5 DRIVER_+12V3_1.. 147.5,111 147.5,99 DRIVER_-12V3_2.. 147.5,98.5 147.5,96.5 DRIVER_-12V3_1.. 147,96 147,81.5 141.5,76 141.5,70 5V/3A_IN-2.. 141.5,69.5 141.5,67.5 5V/3A_IN-1.. 141,67 139.5,65.5 122.5,65.5 121.5,66.5 121.5,68 119.5,70 113.5,70 113,69.5 v109.5,69.5 | v45,69.5 48.5,69.5 51,72 62.5,72 v69,65.5
  Route2 0.152: LED_12V-.. 77,65.5 SWITCH_-2.. | DRIVER_-12V4_1.. 147,20 147,22 DRIVER_-12V4_2.. 147,22.5 147,35 DRIVER_+12V4_1.. 147,35.5 147,37.5 DRIVER_+12V4_2.. 147,38 147,61.5 141.5,67 5V/3A_IN-1..
  Bottom 0.152: SWITCH_-1.. 51,60 49.5,61.5 49.5,65 v45,69.5 44.5,70 24,70 BOOSTER_-12V.. v10.5,83.5 | 105.5,65.5 105.5,62.5 SWITCH_ACC2.. | v109.5,69.5 105.5,65.5 | 105.5,65.5 SWITCH_-2.. | v69,65.5 72.5,65.5 74.5,63.5 LED_12V-..
GND  (via drill 0.35)
  Route2 0.152: v22,42.5 19.5,45 B1.GND1
  Bottom 0.152: 67.5,10 62.5,10 USB-.. | 67.5,10 87.5,10 129,51.5 129,56 125.5,59.5 125.5,60.5 D2.K | v22,42.5 29,42.5 37,34.5 37,10 38.5,8.5 59,8.5 62,5.5 63,5.5 67.5,10
N$1  (via drill 0.35)
  Top 0.152: v90.5,106 90.5,92 LDR1.6
  Bottom 0.152: v90.5,106 51.5,145 48,145 47,146 U$1.39/A20
N$2  (via drill 0.35)
  Top 0.152: v32,121 56,97 57.5,97 58.5,96 DRIBBLER_PWM..
  Bottom 0.152: v32,121 32,131 U$1.10/CS
N$3  (via drill 0.35)
  Top 0.152: v33,121 41.5,112.5 41.5,112 56,97.5 59.5,97.5 61,96 DRIBBLER_DIR..
  Bottom 0.152: v33,121 34,122 34,131 U$1.11/MOSI
N$4  (via drill 0.35)
  Top 0.152: v10,119 10,123 12.5,125.5 13,125.5 29,109.5 30.5,109.5 DRIVER_PWM1..
  Bottom 0.152: v10,119 11,120 11,131 U$1.2
N$5  (via drill 0.35)
  Top 0.152: v9,117 9,86 11.5,83.5 11.5,76 4,68.5 4,52.5 24,32.5 30,32.5 DRIVER_PWM2..
  Bottom 0.152: v9,117 13.5,121.5 13.5,131 U$1.3/CANTX
N$6  (via drill 0.35)
  Route2 0.152: v88.5,106 91,103.5 91,94.5 LDR1.2
  Bottom 0.152: v88.5,106 88.5,107 51.5,144 29,144 27,146 U$1.17/A3
N$7  (via drill 0.35)
  Top 0.152: v89.5,106 89.5,94.5 LDR1.3
  Bottom 0.152: v89.5,106 89.5,106.5 51.5,144.5 31,144.5 29.5,146 U$1.16/A2
N$8  (via drill 0.35)
  Top 0.152: v87.5,107 91.5,107 94.5,104 94.5,92 LDR1.4
  Bottom 0.152: v87.5,107 66,128.5 66,129 51.5,143.5 28,143.5 25.5,146 25.5,147 26,147.5 30.5,147.5 31.5,146.5 U$1.15/A1
N$9  (via drill 0.35)
  Top 0.152: v91.5,106 92.5,105 92.5,92 LDR1.5
  Bottom 0.152: v91.5,106 73.5,124 73,124 53,144 53,147 52.5,147.5 35.5,147.5 34.5,146.5 U$1.14/A0
N$10  (via drill 0.35)
  Route2 0.152: v17,118 29.5,105.5 31,105.5 42,94.5 64,94.5 68.5,99 87,99 88.5,97.5 88.5,93.5 89,93 92.5,93 93.5,94 LDR1.1
  Bottom 0.152: v17,118 17,130 17.5,130.5 17.5,145 18.5,146 U$1.20/A6
N$11
  Route2 0.152: U$1.4/CANRX 16.5,131.5 30.5,145.5 30.5,147 31,147.5 62.5,147.5 64.5,145.5 64.5,144.5 80,129 102.5,129 111,120.5 111,112 121.5,101.5 DRIVER_PWM3..
N$12
  Top 0.152: D3.A 123,145.5 120.5,145.5 SOLENOID-.. 117.5,142.5 77.5,142.5 59.5,124.5 42,124.5 MOSFET_MID..
N$13  (via drill 0.35)
  Route2 0.152: v73.5,127.5 73,127.5 72.5,128 70.5,128 69,126.5 42.5,126.5 42,127 MOSFET_TOP..
  Bottom 0.152: U$2.D2 39.5,28 41,29.5 41,35.5 39.5,37 35,37 28.5,43.5 11,43.5 9.5,45 9.5,83.5 20.5,94.5 32,94.5 33,95.5 33,118.5 41.5,127 MOSFET_TOP.. | v73.5,127.5 73.5,130 76,132.5 112,132.5 125,145.5 128,145.5 R1.P$2
N$14
  Route2 0.152: U$1.5 18.5,131 18.5,126.5 13.5,121.5 13.5,112 31.5,94 71,94 73,96 79,96 107,68 107,57.5 110,54.5 110,40 121,29 122,29 123,28 123,26 122,25 DRIVER_PWM4..
N$16
  Top 0.152: DRIBBLER_CAP-.. 83,115 83,127 C5.1
N$17  (via drill 0.35)
  Top 0.152: v22,121 31,112 DRIVER_DIR1..
  Bottom 0.152: v22,121 22,131 U$1.6
N$18  (via drill 0.35)
  Top 0.152: v53.5,52.5 59,58 59,63.5 LDR2.1
  Route2 0.152: v41.5,106 41.5,114.5 25.5,130.5 25.5,131.5 39,145 48,145 49,146 U$1.38/A19
  Bottom 0.152: v53.5,52.5 53.5,59.5 52.5,60.5 52.5,67 41.5,78 v41.5,106
N$19  (via drill 0.35)
  Top 0.152: v52,69.5 52.5,69.5 57,65 60.5,65 61.5,64 LDR2.2
  Route2 0.152: v48,128 48,142.5 51.5,146 U$1.37/A18
  Bottom 0.152: v52,69.5 52,85.5 43.5,94 43.5,125 46.5,128 v48,128
N$20  (via drill 0.35)
  Top 0.152: v77.5,88.5 77.5,92.5 79,94 79,110.5 84.5,116 84.5,127.5 83.5,128.5 73.5,128.5 72.5,127.5 v72.5,127
  Route2 0.152: v77.5,88.5 77.5,78.5 64,65 64,64 LDR2.3
  Bottom 0.152: v72.5,127 72.5,134.5 61,146 61,146.5 60,147.5 56,147.5 55,146.5 U$1.36/A17
N$21  (via drill 0.35)
  Top 0.152: v51,69.5 52,70.5 56,66.5 58,66.5 LDR2.4
  Route2 0.152: v42.5,96.5 71,125 v73,125
  Bottom 0.152: v51,69.5 42.5,78 v42.5,96.5 | v73,125 57.5,140.5 57.5,146 U$1.35/A16
N$22  (via drill 0.35)
  Top 0.152: v67.5,100.5 67.5,113.5 74.5,120.5 v74.5,127
  Route2 0.152: v69,71 63,65 61.5,65 60.5,66 LDR2.5
  Bottom 0.152: v69,71 70,72 70,88.5 67.5,91 v67.5,100.5 | v74.5,127 73.5,126 72.5,126 60,138.5 60,146 U$1.34/A15
N$23  (via drill 0.35)
  Route2 0.152: v69,72.5 63,66.5 LDR2.6 | v65,128 63.5,129.5 63.5,145 62.5,146 U$1.33/A14
  Bottom 0.152: v69,72.5 69,89 67,91 67,100 65.5,101.5 65.5,127.5 v65,128
N$24  (via drill 0.35)
  Top 0.152: v14.5,121.5 14.5,78.5 4.5,68.5 4.5,52.5 22,35 30,35 DRIVER_DIR2..
  Route2 0.152: v14.5,121.5 24,131 U$1.7
N$25
  Route2 0.152: U$1.8 27,131.5 28,131.5 29,132.5 44.5,132.5 45.5,131.5 45.5,129.5 48,127 69,127 70.5,128.5 102.5,128.5 108.5,122.5 108.5,112 121.5,99 DRIVER_DIR3..
N$26
  Route2 0.152: U$1.9/CS 29.5,131 34.5,126 75.5,126 77.5,128 86.5,128 91,123.5 91,116.5 104.5,103 104.5,86 111.5,79 111.5,76 123.5,64 123.5,24 122,22.5 DRIVER_DIR4..
N$27
  Route2 0.152: C5.2 78,127 78,124 51,97 47,97 46,96 DRIBBLER_CAP+..
N$28  (via drill 0.35)
  Route2 0.152: v27,17 27,20.5 13,34.5 13,56.5 33,76.5 33,79 47,93 70.5,93 73,95.5 76,95.5 76.5,95 76.5,92 ULTRA1.5
  Bottom 0.152: v27,17 39,5 U$2.D11
N$29  (via drill 0.35)
  Top 0.152: v134,85 132,85 121.5,74.5 86,74.5 ULTRA2.5
  Bottom 0.152: v134,85 142.5,85 144.5,83 144.5,65 89,9.5 71,9.5 65,3.5 53.5,3.5 50,7 39.5,7 U$2.D10
N$30  (via drill 0.35)
  Route2 0.152: v50.5,25 53,27.5 53,30.5 54,31.5 55,31.5 64.5,41 71.5,41 75.5,45 75.5,48 ULTRA3.5
  Bottom 0.152: v50.5,25 50.5,22 39.5,11 39.5,10 U$2.D9
N$31  (via drill 0.35)
  Top 0.152: v65,129 65.5,129.5 110,129.5 112.5,127 116,127 C1.1 | v32.5,119.5 32.5,116 31,114.5 DRIVER_CAP-1..
  Bottom 0.152: v65,129 42,129 v32.5,119.5
N$32  (via drill 0.35)
  Top 0.152: v42.5,112 56.5,112 73.5,129 107.5,129 109.5,127 110.5,127 C1.2 | v34,99.5 31,96.5 DRIVER_CAP+1..
  Bottom 0.152: v42.5,112 42.5,108 v34,99.5
N$33  (via drill 0.35)
  Top 0.152: v79.5,87 79.5,97.5 85,103 85,122 91.5,128.5 102.5,128.5 104,127 107.5,127 C2.1
  Route2 0.152: v71,87 55.5,71.5 29.5,71.5 18,60 18,45 25.5,37.5 30,37.5 DRIVER_CAP-2..
  Bottom 0.152: v71,87 v79.5,87
N$34
  Route2 0.152: C2.2 103,126.5 103,105.5 129,79.5 129,25.5 122,18.5 60,18.5 54.5,24 35,24 30.5,19.5 DRIVER_CAP+2..
N$35
  Top 0.152: C3.1 99.5,127 96,127 95,128 94,128 93,127 93,121 117.5,96.5 121.5,96.5 DRIVER_CAP-3..
N$36
  Top 0.152: C3.2 94.5,126.5 94.5,120 98.5,116 119.5,116 121.5,114 DRIVER_CAP+3..
N$37
  Route2 0.152: C4.1 91.5,126.5 91.5,116.5 105,103 105,86 112,79 112,76 124,64 124,22 122,20 DRIVER_CAP-4..
N$38
  Route2 0.152: DRIVER_CAP+4.. 123,39 123,64 104,83 104,95 86.5,112.5 86.5,126.5 C4.2
N$39  (via drill 0.35)
  Route2 0.152: v45.5,30 45.5,31.5 52.5,38.5 52.5,65 63,75.5 66,75.5 ULTRA4.5
  Bottom 0.152: v45.5,30 45.5,19.5 39.5,13.5 39.5,12.5 U$2.D8
N$40
  Route2 0.152: U$2.D7 39,15.5 34,15.5 31.5,18 30,18 15.5,32.5 15.5,58.5 32,75 52,75 69.5,92.5 73.5,92.5 75,94 ULTRA1.2
N$41  (via drill 0.35)
  Route2 0.152: v44.5,27 53,35.5 53,38 64.5,49.5 64.5,63.5 76.5,75.5 88,75.5 ULTRA2.2
  Bottom 0.152: v44.5,27 44.5,23 39.5,18 U$2.D6
N$42  (via drill 0.35)
  Top 0.152: v42.5,25 42.5,28 51.5,37 51.5,39 52,39.5 v64,39.5
  Route2 0.152: v64,39.5 70.5,39.5 76.5,45.5 ULTRA3.2
  Bottom 0.152: v42.5,25 42.5,23.5 39.5,20.5 U$2.D5
N$43  (via drill 0.35)
  Route2 0.152: v44.5,28 52.5,36 52.5,38 57.5,43 57.5,68.5 63.5,74.5 ULTRA4.2
  Bottom 0.152: v44.5,28 39.5,23 U$2.D4
N$44
  pour Top: 35.5,5.25 35.5,68.25 5.5,68.25 5.5,5.25
N$45
  pour Top: 66.5,75.5 85,75.5 85,51 66.5,51
(copper drawn outside any net)
  shapes: Bottom area x14, Top area x13

### Text on the board
Top: BOOSTER | CMPS11
tPlace: BATTERY
tDocu: DRIBBLER | DRIVER1 | DRIVER3 | DRIVER2 | DRIVER4